# Altium schematic sheet power.SchDoc
size A
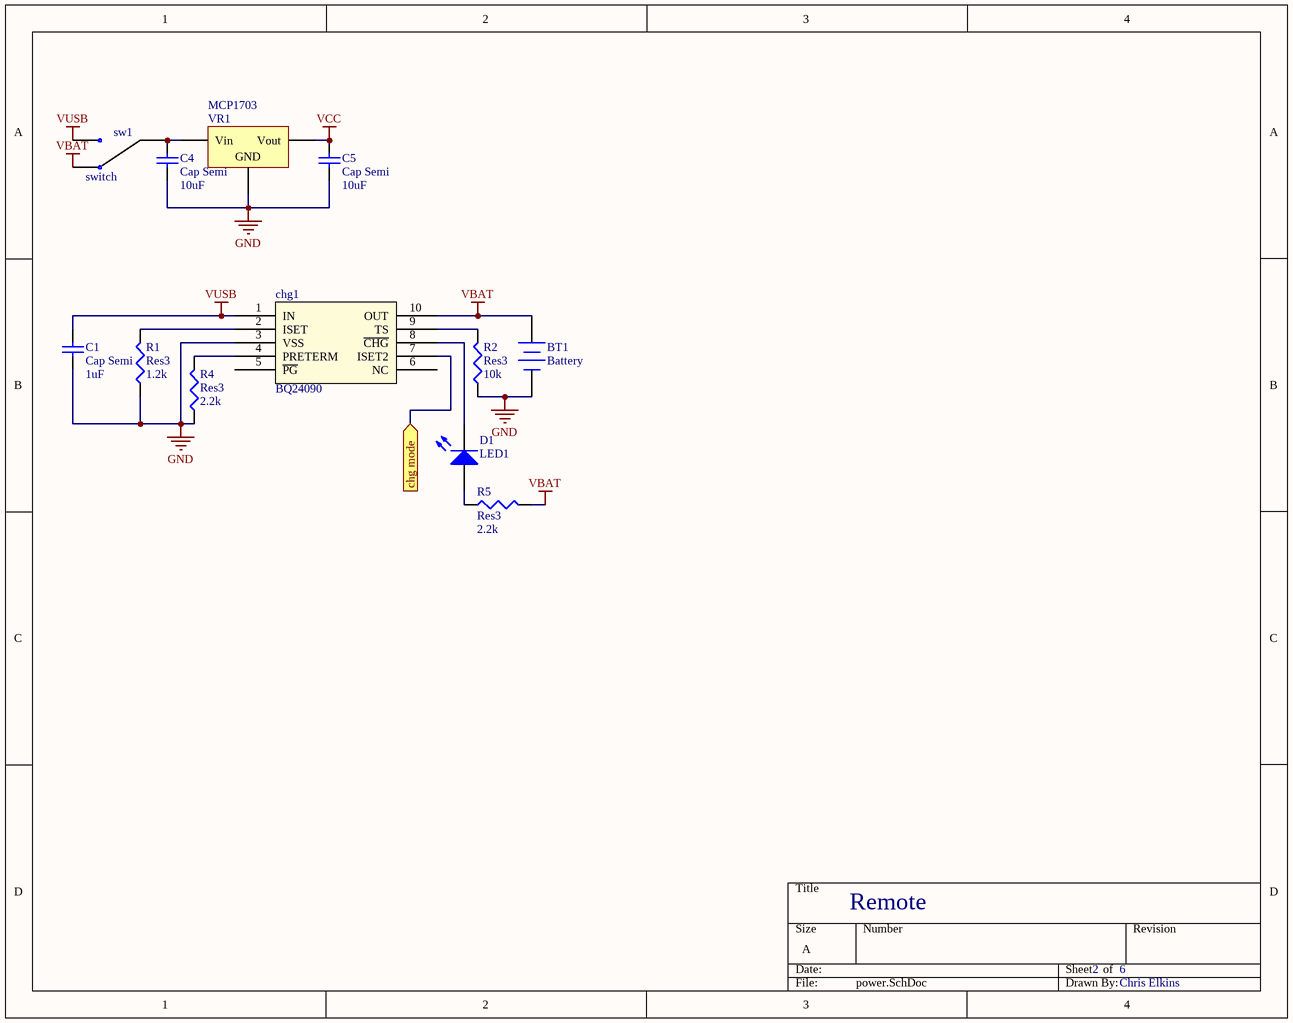
[diagram p0: power.SchDoc]

## Parts
BT1  Battery  [BAT-2]
C1  Cap Semi  value 1uF  [CAPC1608L]
C4  Cap Semi  value 10uF  [CAPC1608L]
C5  Cap Semi  value 10uF  [CAPC1608L]
chg1  BQ24090  [mSOP10]
D1  LED1  [LED-1]
R1  Res3  value 1.2k  [RESC1608L]
R2  Res3  value 10k  [RESC1608L]
R4  Res3  value 2.2k  [RESC1608L]
R5  Res3  value 2.2k  [RESC1608L]
sw1  switch  [switch]
VR1  MCP1703  [SOT223-4N]

## Ports
chg mode (in)

## Nets
GND: BT1.2(-) C1.1 C4.1 C5.1 chg1.3(VSS) R1.1 R2.1 R4.1 VR1.2(GND)
VBAT: BT1.1(+) chg1.10(OUT) R5.2 sw1.1
VCC: C5.2 VR1.3(Vout)
VUSB: C1.2 chg1.1(IN) sw1.3
chg mode: chg1.7(ISET2) ; port chg mode
NetC4_2: C4.2 sw1.2 VR1.1(Vin)
Netchg1_2: chg1.2(ISET) R1.2
Netchg1_4: chg1.4(PRETERM) R4.2
Netchg1_8: chg1.8(~{CHG}) D1.2(K)
Netchg1_9: chg1.9(TS) R2.2
NetD1_1: D1.1(A) R5.1

Not connected (* = marked no-connect by the designer): chg1 5(~{PG}) 6(NC)

## Notes on the sheet
- Remote
- 2
- 6
- Chris Elkins

## Library data of the parts
BT1 = Battery: Multicell Battery; Published: 24-Mar-1999; LatestRevisionDate: 17-Jul-2002; LatestRevisionNote: Re-released for DXP Platform.; PackageReference: BAT-2; Publisher: Altium Limited
C1 C4 C5 = Cap Semi: Capacitor (Semiconductor SIM Model); Published: 8-Jun-2000; LatestRevisionDate: 29-May-2009; LatestRevisionNote: IPC-7351 Footprint Added.; PackageReference: C1206; Publisher: Altium Limited; PackageDescription: Chip Capacitor
chg1 = BQ24090: Li+ battery charger
D1 = LED1: Typical RED GaAs LED; Published: 8-Jun-2000; LatestRevisionDate: 08-Jul-2005; LatestRevisionNote: Mech Layer 1 removed.; PackageReference: LED-1; Publisher: Altium Limited
R1 R2 R4 R5 = Res3: Resistor; Published: 8-Jun-2000; LatestRevisionDate: 29-May-2009; LatestRevisionNote: IPC-7351 Footprint Added.; PackageReference: J1-0603; Publisher: Altium Limited; PackageDescription: Chip Resistor
VR1 = Volt Reg: Voltage Regulator; Published: 24-Mar-1999; LatestRevisionDate: 29-May-2009; LatestRevisionNote: IPC-7351 Footprint Added.; PackageReference: D2PAK; Publisher: Altium Limited; PackageDescription: 3-Pin Transistor Outline Package 2.54 mm Pitch, 15.1 mm Lead Span